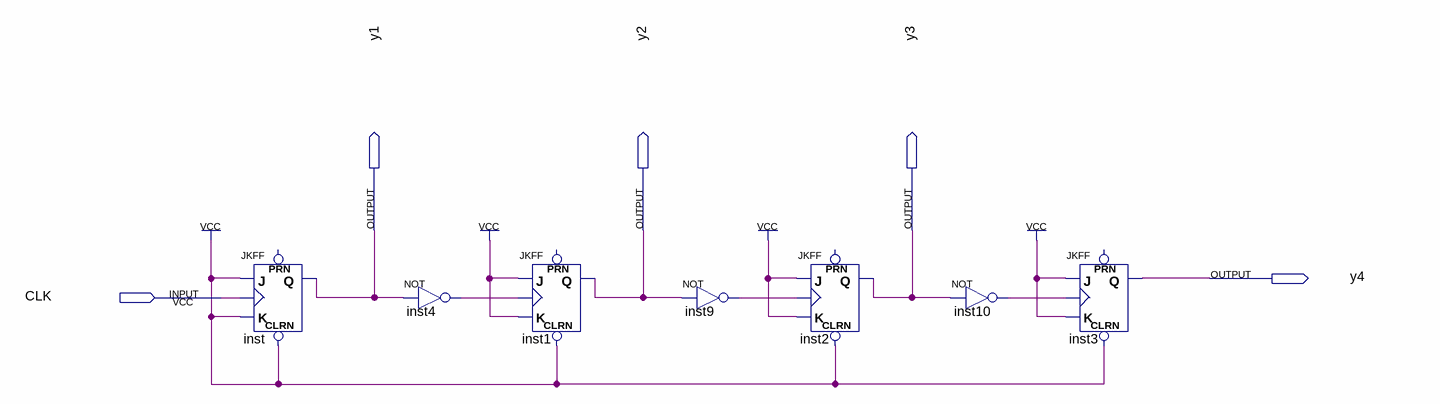
[diagram p0: schematic sheet]
// Quartus schematic binaryupcounter.bdf as structural Verilog: 7 symbols, 5 pins
module binaryupcounter (
  input  CLK,
  output y1,
  output y2,
  output y3,
  output y4
);

  wire inst4_out, inst9_out, inst10_out;

  JKFF inst (.CLRN(1'b1), .K(1'b1), .J(1'b1), .CLK(CLK), .Q(y1));  // open: PRN
  not inst4 (inst4_out, y1);
  JKFF inst1 (.CLRN(1'b1), .K(1'b1), .J(1'b1), .CLK(inst4_out), .Q(y2));  // open: PRN
  not inst9 (inst9_out, y2);
  JKFF inst2 (.CLRN(1'b1), .K(1'b1), .J(1'b1), .CLK(inst9_out), .Q(y3));  // open: PRN
  not inst10 (inst10_out, y3);
  JKFF inst3 (.CLRN(1'b1), .K(1'b1), .J(1'b1), .CLK(inst10_out), .Q(y4));  // open: PRN
endmodule
